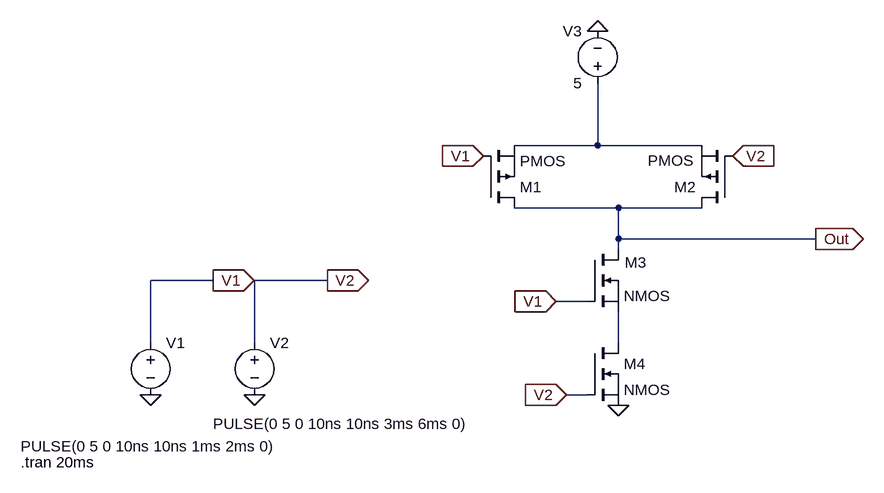
[diagram p0: schematic NAND.asc]
NAND.asc, the LTspice schematic file:
Version 4
SHEET 1 1128 680
WIRE 480 -64 480 -160
WIRE 480 -64 352 -64
WIRE 640 -64 480 -64
WIRE 512 32 352 32
WIRE 640 32 512 32
WIRE 512 80 512 32
WIRE 816 80 512 80
WIRE 512 96 512 80
WIRE -112 144 -208 144
WIRE 64 144 -48 144
WIRE 464 176 416 176
WIRE -208 240 -208 144
WIRE -48 240 -48 144
WIRE 512 240 512 192
WIRE 464 320 432 320
FLAG 480 -240 0
FLAG 512 336 0
FLAG 688 -48 V2
IOPIN 688 -48 In
FLAG 304 -48 V1
IOPIN 304 -48 In
FLAG 432 320 V2
IOPIN 432 320 In
FLAG 416 176 V1
IOPIN 416 176 In
FLAG -208 320 0
FLAG -48 320 0
FLAG 64 144 V2
IOPIN 64 144 Out
FLAG -112 144 V1
IOPIN -112 144 Out
FLAG 816 80 Out
IOPIN 816 80 Out
SYMBOL voltage 480 -144 R180
WINDOW 0 24 96 Left 2
WINDOW 3 24 16 Left 2
WINDOW 123 0 0 Left 0
WINDOW 39 0 0 Left 0
SYMATTR InstName V3
SYMATTR Value 5
SYMBOL voltage -208 224 R0
WINDOW 3 -200 175 Left 2
WINDOW 123 0 0 Left 0
WINDOW 39 0 0 Left 0
SYMATTR Value PULSE(0 5 0 10ns 10ns 1ms 2ms 0)
SYMATTR InstName V1
SYMBOL voltage -48 224 R0
WINDOW 3 -64 141 Left 2
WINDOW 123 0 0 Left 0
WINDOW 39 0 0 Left 0
SYMATTR Value PULSE(0 5 0 10ns 10ns 3ms 6ms 0)
SYMATTR InstName V2
SYMBOL pmos 304 32 M180
SYMATTR InstName M1
SYMBOL pmos 688 32 R180
WINDOW 3 60 73 Left 2
SYMATTR InstName M2
SYMBOL nmos 464 96 R0
WINDOW 0 58 20 Left 2
SYMATTR InstName M3
SYMBOL nmos 464 240 R0
SYMATTR InstName M4
TEXT -408 424 Left 2 !.tran 20ms

The netlist it stands for:
* NAND.asc
V3 N001 0 5
V1 V1 0 PULSE(0 5 0 10ns 10ns 1ms 2ms 0)
V2 V2 0 PULSE(0 5 0 10ns 10ns 3ms 6ms 0)
M1 Out V1 N001 N001 PMOS
M2 Out V2 N001 N001 PMOS
M3 Out V1 N002 N002 NMOS
M4 N002 V2 0 0 NMOS
.model NMOS NMOS
.model PMOS PMOS
.lib standard.mos
.tran 20ms
.backanno
.end